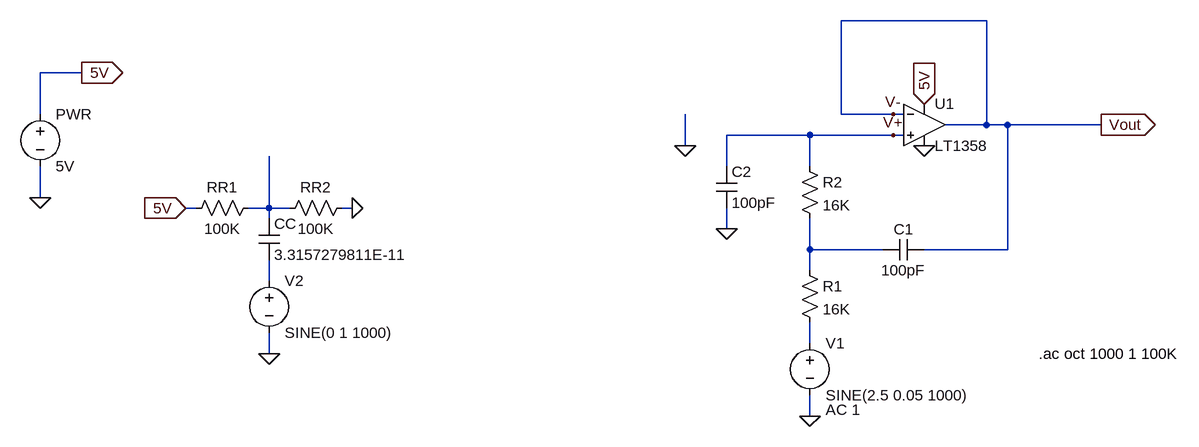
[diagram p0: schematic Opampwithbiasandlowpass.asc]
Opampwithbiasandlowpass.asc, the LTspice schematic file:
Version 4
SHEET 1 2040 880
WIRE 1728 256 1504 256
WIRE 336 336 272 336
WIRE 272 400 272 336
WIRE 1504 400 1504 256
WIRE 1584 400 1504 400
WIRE 1600 400 1584 400
WIRE 1728 416 1728 256
WIRE 1728 416 1664 416
WIRE 1760 416 1728 416
WIRE 1904 416 1760 416
WIRE 1456 432 1328 432
WIRE 1584 432 1456 432
WIRE 1600 432 1584 432
WIRE 1264 448 1264 400
WIRE 1328 480 1328 432
WIRE 1456 480 1456 432
WIRE 272 528 272 480
WIRE 512 544 496 544
WIRE 624 544 624 464
WIRE 624 544 592 544
WIRE 656 544 624 544
WIRE 752 544 736 544
WIRE 624 560 624 544
WIRE 1328 576 1328 544
WIRE 1456 608 1456 560
WIRE 1568 608 1456 608
WIRE 1760 608 1760 416
WIRE 1760 608 1632 608
WIRE 1456 640 1456 608
WIRE 624 656 624 624
WIRE 1456 752 1456 720
WIRE 624 768 624 736
WIRE 1456 864 1456 832
FLAG 272 528 0
FLAG 336 336 5V
IOPIN 336 336 Out
FLAG 624 768 0
FLAG 752 544 0
FLAG 496 544 5V
IOPIN 496 544 In
FLAG 1632 448 0
FLAG 1632 384 5V
IOPIN 1632 384 In
FLAG 1456 864 0
FLAG 1904 416 Vout
IOPIN 1904 416 Out
FLAG 1584 400 V-
FLAG 1584 432 V+
FLAG 1264 448 0
FLAG 1328 576 0
SYMBOL Voltage 272 384 R0
SYMATTR InstName PWR
SYMATTR Value 5V
SYMBOL Voltage 624 640 R0
SYMATTR InstName V2
SYMATTR Value SINE(0 1 1000)
SYMBOL Res 608 528 R90
WINDOW 0 0 56 VBottom 2
WINDOW 3 32 56 VTop 2
SYMATTR InstName RR1
SYMATTR Value 100K
SYMBOL Res 752 528 R90
WINDOW 0 0 56 VBottom 2
WINDOW 3 32 56 VTop 2
SYMATTR InstName RR2
SYMATTR Value 100K
SYMBOL Cap 608 560 R0
SYMATTR InstName CC
SYMATTR Value 3.3157279811E-11
SYMBOL OpAmps/LT1358 1632 352 R0
SYMATTR InstName U1
SYMBOL Voltage 1456 736 R0
WINDOW 123 24 118 Left 2
SYMATTR Value2 AC 1
SYMATTR InstName V1
SYMATTR Value SINE(2.5 0.05 1000)
SYMBOL Cap 1312 480 R0
SYMATTR InstName C2
SYMATTR Value 100pF
SYMBOL Res 1440 624 R0
SYMATTR InstName R1
SYMATTR Value 16K
SYMBOL Res 1440 464 R0
SYMATTR InstName R2
SYMATTR Value 16K
SYMBOL Cap 1632 592 R90
WINDOW 0 0 32 VBottom 2
WINDOW 3 32 32 VTop 2
SYMATTR InstName C1
SYMATTR Value 100pF
TEXT 1808 768 Left 2 !.ac oct 1000 1 100K

The netlist it stands for:
* Opampwithbiasandlowpass.asc
V§PWR 5V 0 5V
V2 N003 0 SINE(0 1 1000)
RR1 N001 5V 100K
RR2 0 N001 100K
CC N001 N003 3.3157279811E-11
XU1 V+ V- 5V 0 V- LT1357  ; LT1358, pins In+ In- V+ V- OUT
V1 N004 0 SINE(2.5 0.05 1000) AC 1
C2 V+ 0 100pF
R1 N002 N004 16K
R2 V+ N002 16K
C1 V- N002 100pF
.ac oct 1000 1 100K
.lib LTC.lib
.backanno
.end